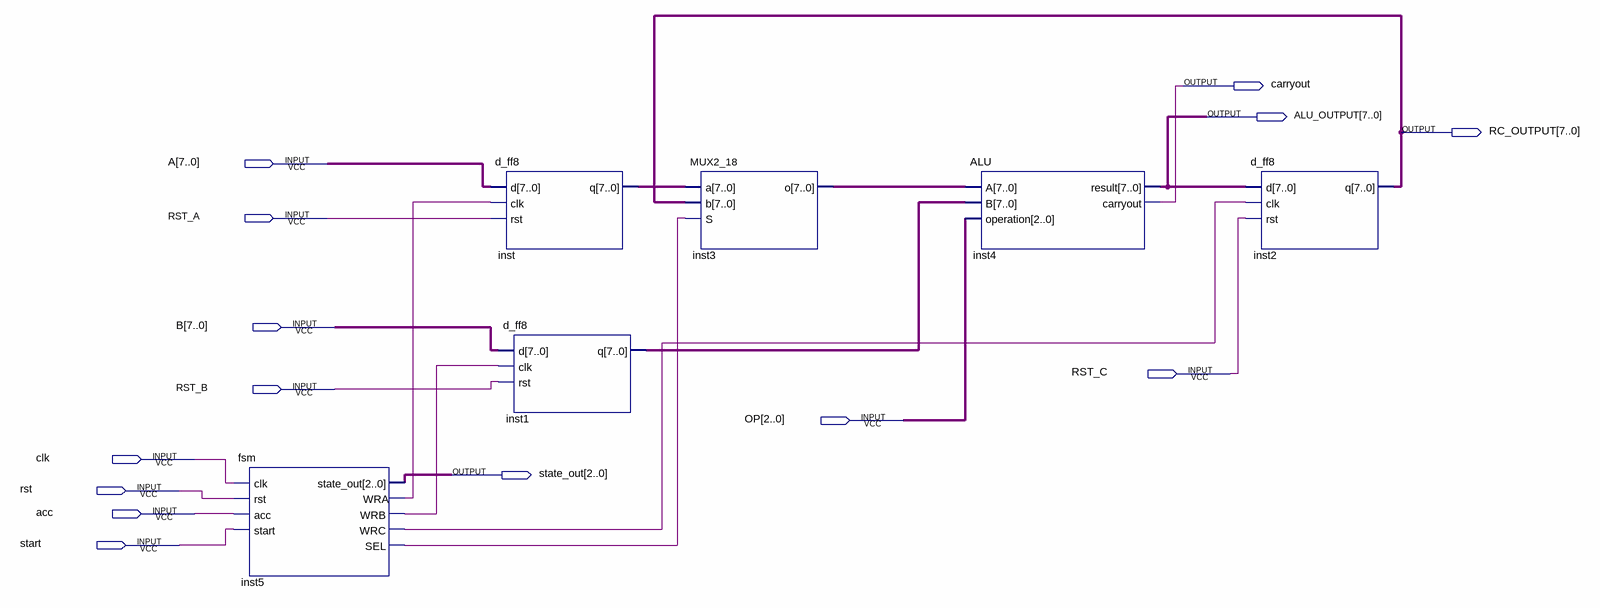
[diagram p0: schematic sheet]
// Quartus schematic alu_structural.bdf as structural Verilog: 6 symbols, 14 pins
module alu_structural (
  input  [7:0] A,
  input  RST_A,
  input  [7:0] B,
  input  RST_C,
  input  RST_B,
  input  [2:0] OP,
  input  clk,
  input  rst,
  input  acc,
  input  start,
  output carryout,
  output [7:0] ALU_OUTPUT,
  output [7:0] RC_OUTPUT,
  output [2:0] state_out
);

  wire inst5_sel, inst5_wra, inst5_wrb, inst5_wrc;
  wire [7:0] inst1_q, inst3_o, inst_q;

  fsm inst5 (
    .clk(clk), .rst(rst), .acc(acc), .start(start), .state_out(state_out), .WRA(inst5_wra), .WRB(inst5_wrb),
    .WRC(inst5_wrc), .SEL(inst5_sel));
  d_ff8 inst (.d(A), .clk(inst5_wra), .rst(RST_A), .q(inst_q));
  d_ff8 inst1 (.d(B), .clk(inst5_wrb), .rst(RST_B), .q(inst1_q));
  MUX2_18 inst3 (.a(inst_q), .b(RC_OUTPUT), .S(inst5_sel), .o(inst3_o));
  ALU inst4 (.A(inst3_o), .B(inst1_q), .operation(OP), .result(ALU_OUTPUT), .carryout(carryout));
  d_ff8 inst2 (.d(ALU_OUTPUT), .clk(inst5_wrc), .rst(RST_C), .q(RC_OUTPUT));
endmodule
